# EAGLE design LED Control (EAGLE 6.5.0)
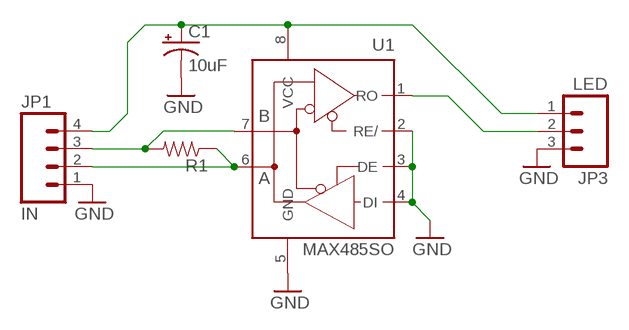
[diagram p0: schematic, sheet 1]

## Parts
C1  10uF  10UF-16V-10%(TANT)  [EIA3216]
JP1  IN  M04POLAR_LOCK  [MOLEX-1X4_LOCK]
JP3  LED  M03LOCK  [1X03_LOCK]
R1  RESISTOR0805-RES  [0805]
U1  MAX485SO  [SO08]

## Nets
GND: C1.C(-) JP1.1 JP3.3 U1.2(RE/) U1.3(DE) U1.4(DI) U1.5(GND)
N$1: JP1.3 R1.2 U1.7(B)
N$2: JP1.2 R1.1 U1.6(A)
N$5: C1.A(+) JP1.4 JP3.1 U1.8(VCC)
N$6: JP3.2 U1.1(RO)

## Library data of the parts
C1 = SparkFun-Capacitors:10UF-16V-10%(TANT): CAP-00811 1206/EIA-3216 Tantalum capacitor; PROD_ID: CAP-00811
JP1 = SparkFun-Connectors:M04: Header 4 Standard 4-pin 0.1" header. Use with straight break away headers (SKU : PRT-00116), right angle break away headers (PRT-00553), swiss pins (PRT-00743), machine pins (PRT-00117), and female headers (PRT-00115). Molex polarized connector foot print use with SKU : PRT-08231 with associated crimp pins and housings. 1MM SMD Version SKU: PRT-10208
JP3 = SparkFun-Connectors:M03: Header 3 Standard 3-pin 0.1" header. Use with straight break away headers (SKU : PRT-00116), right angle break away headers (PRT-00553), swiss pins (PRT-00743), machine pins (PRT-00117), and female headers (PRT-00115). Molex polarized connector foot print use with SKU : PRT-08232 with associated crimp pins and housings.
R1 = SparkFun-Passives:RESISTOR: Resistor Basic schematic elements and footprints for 0603, 1206, and PTH resistors.
U1 = NASA_LIB:MAX485

## Board
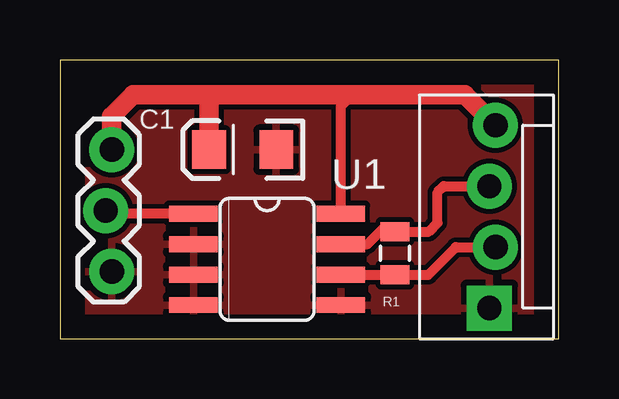
[diagram p1: board, top side]

Size 20.81 x 11.61 mm. Coordinates in mm from the lower left corner, seen from the top.
Outline: 0,0 20.81,0 20.81,11.61 0,11.61 0,0
Copper layers (1*16): Top 0.035mm / dielectric 1.5mm / Bottom 0.035mm
Design rules "default": minimum track width 10mil, minimum drill 24mil, track to track 8mil, track to pad 8mil, pad to pad 8mil, via to via 8mil, smd to smd 8mil, copper to edge 40mil, drill to drill 8mil, minimum pad ring 10mil, minimum via ring 8mil, stop-mask expansion 4mil, vias tented up to drill 0mil, thermal gap 10mil

### Footprints (pad centres in the part's own frame; a part is rotated, then mirrored left to right if it is on the bottom)
EIA3216 = smd 1.4 x 1.6: A 1.4,0; C -1.4,0
MOLEX-1X4_LOCK = drill 1.016 pad 1.88 square: 1 0,0.127 | drill 1.016 pad 1.88: 2 2.54,-0.127; 3 5.08,0.127; 4 7.62,-0.127
1X03_LOCK = drill 1.016 pad 1.88: 1 0,0.127; 2 2.54,-0.127; 3 5.08,0.127
0805 = smd 0.8 x 1.2: 1 -0.9,0; 2 0.9,0
SO08 = smd 0.66 x 2.032: 1 -1.905,-3.073; 2 -0.635,-3.073; 3 0.635,-3.073; 4 1.905,-3.073; 5 1.905,3.073; 6 0.635,3.073; 7 -0.635,3.073; 8 -1.905,3.073

### Placement (x,y rotation side)
C1  7.62,7.87 180 top
JP1  18.03,1.27 90 top
JP3  2.03,7.87 270 top
R1  13.97,3.56 90 top
U1  8.64,3.3 270 top

### Tracks (layer width: path | path; a pad name or v marks a point on that pad's centre or on a via)
GND
  pour Top: 0,0 20.83,0 20.83,11.43 0,11.43
N$1
  Top 0.406: U1.7 12.83,3.94 13.46,4.57 14.09,4.57 R1.2 15.38,4.46 15.75,4.83 15.75,6.1 16,6.35 JP1.3
N$2
  Top 0.406: U1.6 13.71,2.67 R1.1 15.36,2.66 16.51,3.81 JP1.2
N$5
  Top 0.406: U1.8 11.71,9.68 12.19,10.16
  Top 0.813: JP3.1 2.16,9.27 3.05,10.16 6.35,10.16 | 6.35,10.16 12.19,10.16 16.89,10.16 JP1.4 | C1.A 6.22,10.03 6.35,10.16
N$6
  Top 0.406: U1.1 2.54,5.21 JP3.2